# Altium schematic sheet Main.SchDoc
size A4; SheetNumber: 1; SheetTotal: 4
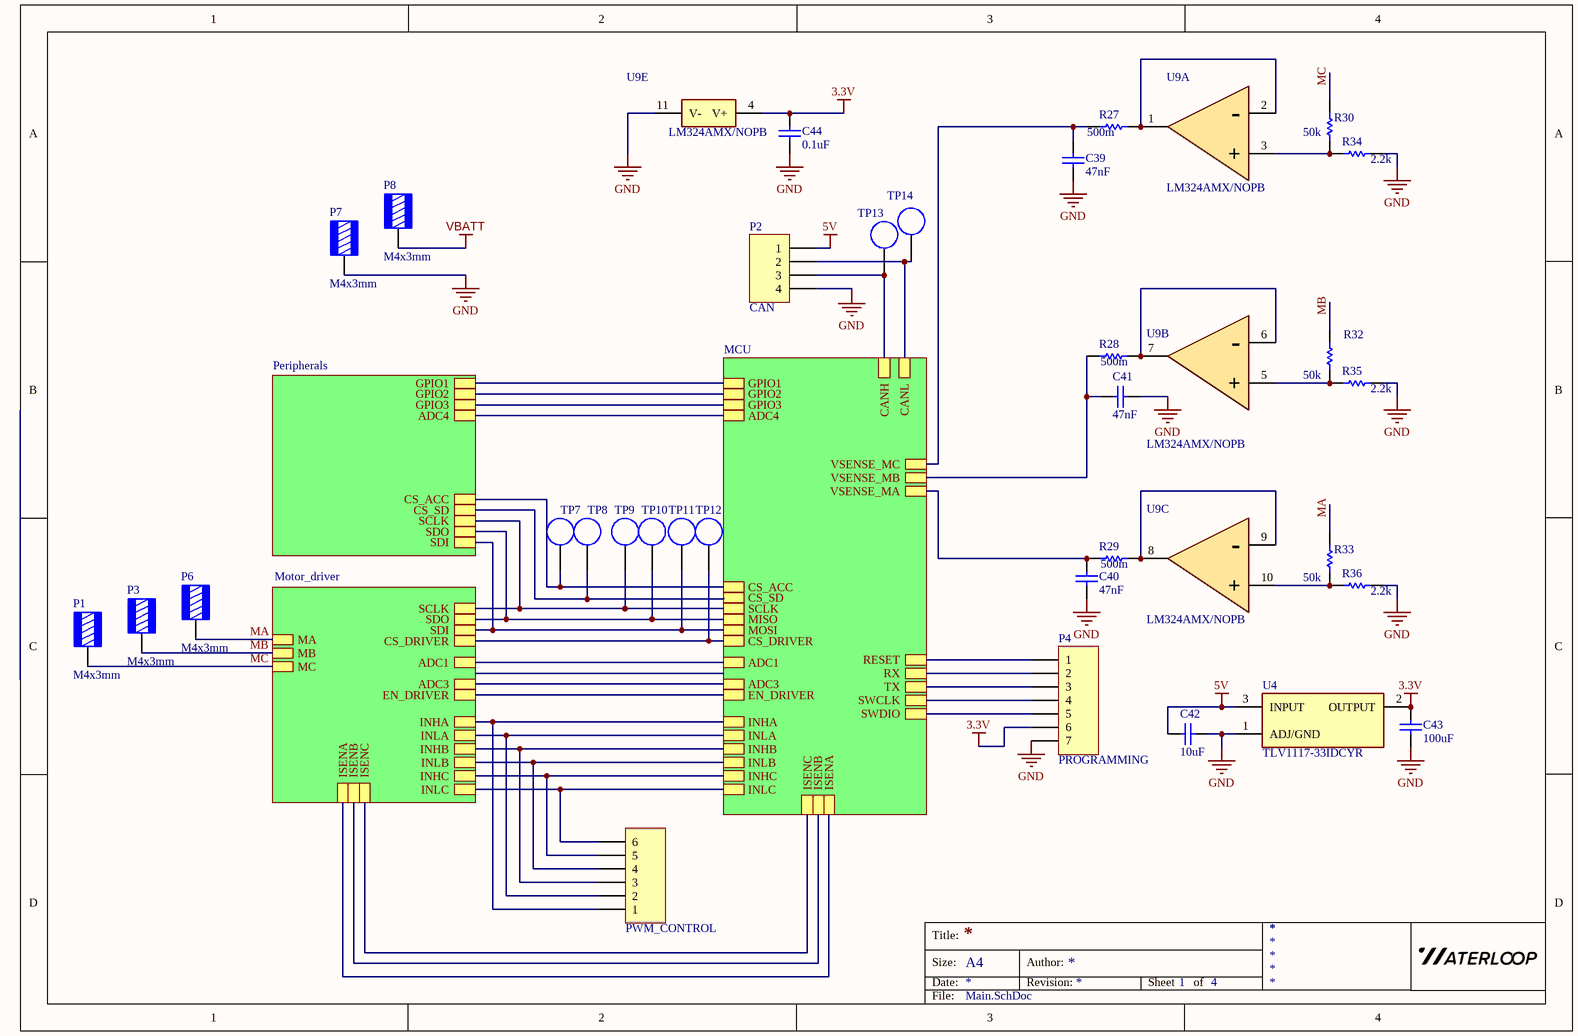
[diagram p0: Main.SchDoc]

## Parts
?  PWM_CONTROL  [B6B-XH-A(LF)(SN)]
C39  value 47nF  [0805 - Capacitor]  (hidden comment: 100V)
C40  value 47nF  [0805 - Capacitor]  (hidden comment: 100V)
C41  value 47nF  [0805 - Capacitor]  (hidden comment: 100V)
C42  value 10uF  [0805 - Capacitor]  (hidden comment: 100V)
C43  value 100uF  [0805 - Capacitor]  (hidden comment: 100V)
C44  value 0.1uF  [0805 - Capacitor]  (hidden comment: 100V)
P1  M4x3mm  [74650094]
P2  CAN  [b4b-xh]
P3  M4x3mm  [74650094]
P4  PROGRAMMING  [HDR1X7]
P6  M4x3mm  [74650094]
P7  M4x3mm  [74650094]
P8  M4x3mm  [74650094]
R27  500m  [0603 - Resistor]
R28  500m  [0603 - Resistor]
R29  500m  [0603 - Resistor]
R30  50k  [0603 - Resistor]
R32  50k  [0603 - Resistor]
R33  50k  [0603 - Resistor]
R34  2.2k  [0603 - Resistor]
R35  2.2k  [0603 - Resistor]
R36  2.2k  [0603 - Resistor]
TP7  Test Point  [Test Point]  (value not drawn)  (no BOM)
TP8  Test Point  [Test Point]  (value not drawn)  (no BOM)
TP9  Test Point  [Test Point]  (value not drawn)  (no BOM)
TP10  Test Point  [Test Point]  (value not drawn)  (no BOM)
TP11  Test Point  [Test Point]  (value not drawn)  (no BOM)
TP12  Test Point  [Test Point]  (value not drawn)  (no BOM)
TP13  Test Point  [Test Point]  (value not drawn)  (no BOM)
TP14  Test Point  [Test Point]  (value not drawn)  (no BOM)
U4  TLV1117-33IDCYR  [TLV1117]
U9  LM324AMX/NOPB  [LM324AMX/NOPB]  (parts A,B,C,E of 5)

## Sub-sheets
MCU = MCU.SchDoc: CANH, CANL, MOSI, MISO, SCLK, ADC1, INLA, INHA, INHB, INHC, GPIO2, INLB, INLC, SWDIO, SWCLK, TX, GPIO3, RX, GPIO1, CS_SD, ADC4, ADC3, ISENA, ISENB, ISENC, RESET, CS_ACC, CS_DRIVER, EN_DRIVER, VSENSE_MC, VSENSE_MB, VSENSE_MA
Motor_driver = Motor_driver.SchDoc: SCLK, MA, MB, MC, INHA, INLA, INLC, INLB, INHB, INHC, SDO, SDI, ADC1, ADC3, ISENC, ISENA, ISENB, EN_DRIVER, CS_DRIVER
Peripherals = Peripherals.SchDoc: SCLK, GPIO1, GPIO2, GPIO3, SDI, SDO, CS_SD, ADC4, CS_ACC

## Nets
3.3V: C43.1 C44.2 P4.6 U4.2(OUTPUT) U9.4(V+)
5V: C42.1 P2.1 U4.3(INPUT)
GND: C39.1 C40.1 C41.1 C42.2 C43.2 C44.1 P2.4 P4.7 P7.1 R34.1 R35.1 R36.1 U4.1(ADJ/GND) U9.11(V-)
VBATT: P8.1
MA: P6.1 R33.1 ; sheet Motor_driver/MA
MB: P3.1 R32.1 ; sheet Motor_driver/MB
MC: P1.1 R30.1 ; sheet Motor_driver/MC
Net?_1: ?.1 ; sheet MCU/INHA, sheet Motor_driver/INHA
Net?_2: ?.2 ; sheet MCU/INLA, sheet Motor_driver/INLA
Net?_3: ?.3 ; sheet MCU/INHB, sheet Motor_driver/INHB
Net?_4: ?.4 ; sheet MCU/INLB, sheet Motor_driver/INLB
Net?_5: ?.5 ; sheet MCU/INHC, sheet Motor_driver/INHC
Net?_6: ?.6 ; sheet MCU/INLC, sheet Motor_driver/INLC
NetC39_2: C39.2 R27.2 ; sheet MCU/VSENSE_MC
NetC40_2: C40.2 R29.2 ; sheet MCU/VSENSE_MA
NetC41_2: C41.2 R28.2 ; sheet MCU/VSENSE_MB
NetP2_2: P2.2 TP14.0 ; sheet MCU/CANL
NetP2_3: P2.3 TP13.0 ; sheet MCU/CANH
NetP4_1: P4.1 ; sheet MCU/RESET
NetP4_2: P4.2 ; sheet MCU/RX
NetP4_3: P4.3 ; sheet MCU/TX
NetP4_4: P4.4 ; sheet MCU/SWCLK
NetP4_5: P4.5 ; sheet MCU/SWDIO
NetR27_1: R27.1 U9.1 U9.2(-)
NetR28_1: R28.1 U9.6(-) U9.7
NetR29_1: R29.1 U9.8 U9.9(-)
NetR30_2: R30.2 R34.2 U9.3(+)
NetR32_2: R32.2 R35.2 U9.5(+)
NetR33_2: R33.2 R36.2 U9.10(+)
NetTP7_0: TP7.0 ; sheet MCU/CS_ACC, sheet Peripherals/CS_ACC
NetTP8_0: TP8.0 ; sheet MCU/CS_SD, sheet Peripherals/CS_SD
NetTP9_0: TP9.0 ; sheet MCU/SCLK, sheet Motor_driver/SCLK, sheet Peripherals/SCLK
NetTP10_0: TP10.0 ; sheet MCU/MISO, sheet Motor_driver/SDO, sheet Peripherals/SDO
NetTP11_0: TP11.0 ; sheet MCU/MOSI, sheet Motor_driver/SDI, sheet Peripherals/SDI
NetTP12_0: TP12.0 ; sheet MCU/CS_DRIVER, sheet Motor_driver/CS_DRIVER
(unnamed): sheet MCU/ADC1, sheet Motor_driver/ADC1
(unnamed): sheet MCU/GPIO2, sheet Peripherals/GPIO2
(unnamed): sheet MCU/GPIO3, sheet Peripherals/GPIO3
(unnamed): sheet MCU/GPIO1, sheet Peripherals/GPIO1
(unnamed): sheet MCU/ADC4, sheet Peripherals/ADC4
(unnamed): sheet MCU/ADC3, sheet Motor_driver/ADC3
(unnamed): sheet MCU/ISENA, sheet Motor_driver/ISENA
(unnamed): sheet MCU/ISENB, sheet Motor_driver/ISENB
(unnamed): sheet MCU/ISENC, sheet Motor_driver/ISENC
(unnamed): sheet MCU/EN_DRIVER, sheet Motor_driver/EN_DRIVER

## Notes on the sheet
- Title:
- Size:
- Date:
- A4
- Author:
- Revision:
- Sheet
- of
- File:

## Library data of the parts
? = Header 6: Header, 6-Pin; LatestRevisionDate: 17-Jul-2002; LatestRevisionNote: Re-released for DXP Platform.; Publisher: Altium Limited
C39-C44 = Capacitor - Nonpolarized: CL21B104KCFNNNE, MULTILAYER CERAMIC CAPACITORS MLCC - SMD/SMT 100NF 100V 0805 ROHS; Supplier Part Number: *; Supplier: *; Manufacturer: *; Rating: *; Manufacturer Part Number: *
P1 P3 P6-P8 = 74650094R: WP-THRBU REDCUBE THR internal through-hole thread, 10x10mm, M4x3mm, 8 pins, 85A; Pin Number: 8; Thread: M4; Surface: Tin; Thread Length: 3mm; ComponentLink1Description: Manufacturer; ComponentLink1URL: http://www.we-online.de; ComponentLink2Description: Datasheet; ComponentLink2URL: https://katalog.we-online.com/em/datasheet/74650094R.pdf; Operating Temperature: -55 to +150degC; Height: 3.5mm; Material: Brass; Part Number: 74650094R; Packaging: Tape and Reel; Mounting Technology: SMT; Rated Current: 85A; Publisher: Wurth Elektronik; Published Date: September 2019; Size: 10x10mm
P2 = Header 4: Header, 4-Pin; LatestRevisionDate: 17-Jul-2002; LatestRevisionNote: Re-released for DXP Platform.; Publisher: Altium Limited
P4 = Header 7: Header, 7-Pin; LatestRevisionDate: 17-Jul-2002; LatestRevisionNote: Re-released for DXP Platform.; Publisher: Altium Limited
R27-R30 R32-R36 = Resistor: Rating: *; Manufacturer Part Number: *; Manufacturer: *; Supplier Part Number: *; Supplier: *
  R27-R29: Value: 500m
  R30 R32 R33: Value: 50k
  R34-R36: Value: 2.2k
U4 = TLV1117-33IDCYR: Linear Voltage Regulator IC 3.3V 800MA SOT223-4; Manufacturer: Texas Instruments; Datasheet: http://www.ti.com/lit/ds/symlink/tlv1117.pdf?HQS=TI-null-null-digikeymode-df-pf-null-wwe&ts=1590668900314; Manufacturer Part Number: TLV1117-33IDCYR; Supplier Part Number: 296-21112-1-ND; Supplier: Digikey
U9 = LM324AMX/NOPB: Gen Purp 4Ch Opamp; Manufacturer: TI; Manufacturer Part Number: LM324AMX/NOPB; Supplier Part Number: LM324AMX/NOPBCT-ND; Supplier: Digikey; ComponentLink1Description: Datasheet; ComponentLink1URL: https://www.ti.com/lit/ds/symlink/lm124-n.pdf?HQS=dis-dk-null-digikeymode-dsf-pf-null-wwe&ts=1616555832552